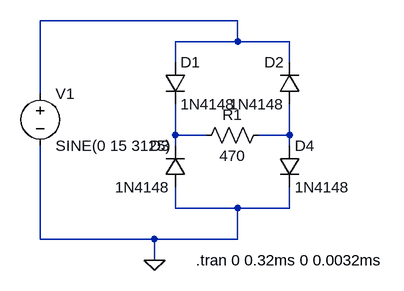
[diagram p0: schematic Fullwave_Rectifier.asc]
Fullwave_Rectifier.asc, the LTspice schematic file:
Version 4
SHEET 1 880 680
WIRE 224 0 -80 0
WIRE 224 32 224 0
WIRE 224 32 128 32
WIRE 304 32 224 32
WIRE 128 64 128 32
WIRE 304 64 304 32
WIRE -80 112 -80 0
WIRE 128 176 128 128
WIRE 176 176 128 176
WIRE 304 176 304 128
WIRE 304 176 256 176
WIRE 128 192 128 176
WIRE 304 192 304 176
WIRE 128 288 128 256
WIRE 224 288 128 288
WIRE 304 288 304 256
WIRE 304 288 224 288
WIRE -80 336 -80 192
WIRE 96 336 -80 336
WIRE 224 336 224 288
WIRE 224 336 96 336
WIRE 96 368 96 336
FLAG 96 368 0
SYMBOL diode 112 64 R0
SYMATTR InstName D1
SYMATTR Value 1N4148
SYMBOL diode 320 128 R180
WINDOW 0 24 64 Left 2
WINDOW 3 24 0 Left 2
SYMATTR InstName D2
SYMATTR Value 1N4148
SYMBOL diode 144 256 R180
WINDOW 0 24 64 Left 2
WINDOW 3 24 0 Left 2
SYMATTR InstName D3
SYMATTR Value 1N4148
SYMBOL diode 288 192 R0
SYMATTR InstName D4
SYMATTR Value 1N4148
SYMBOL res 272 160 R90
WINDOW 0 0 56 VBottom 2
WINDOW 3 32 56 VTop 2
SYMATTR InstName R1
SYMATTR Value 470
SYMBOL voltage -80 96 R0
WINDOW 123 0 0 Left 0
WINDOW 39 0 0 Left 0
SYMATTR InstName V1
SYMATTR Value SINE(0 15 3125)
TEXT 160 368 Left 2 !.tran 0 0.32ms 0 0.0032ms

The netlist it stands for:
* Fullwave_Rectifier.asc
D1 N001 N002 1N4148
D2 N003 N001 1N4148
D3 0 N002 1N4148
D4 N003 0 1N4148
R1 N003 N002 470
V1 N001 0 SINE(0 15 3125)
.model D D
.lib standard.dio
.tran 0 0.32ms 0 0.0032ms
.backanno
.end